# Altium schematic sheet Ram.SchDoc
size A3; Author: ALP Electronics; CompanyName: ALP Electronics; DrawnBy: Caner Alp; Engineer: Caner Alp; Organization: ALP Electronics; Address2: Västerås; Address4: Sweden; SheetNumber: 5; SheetTotal: 11
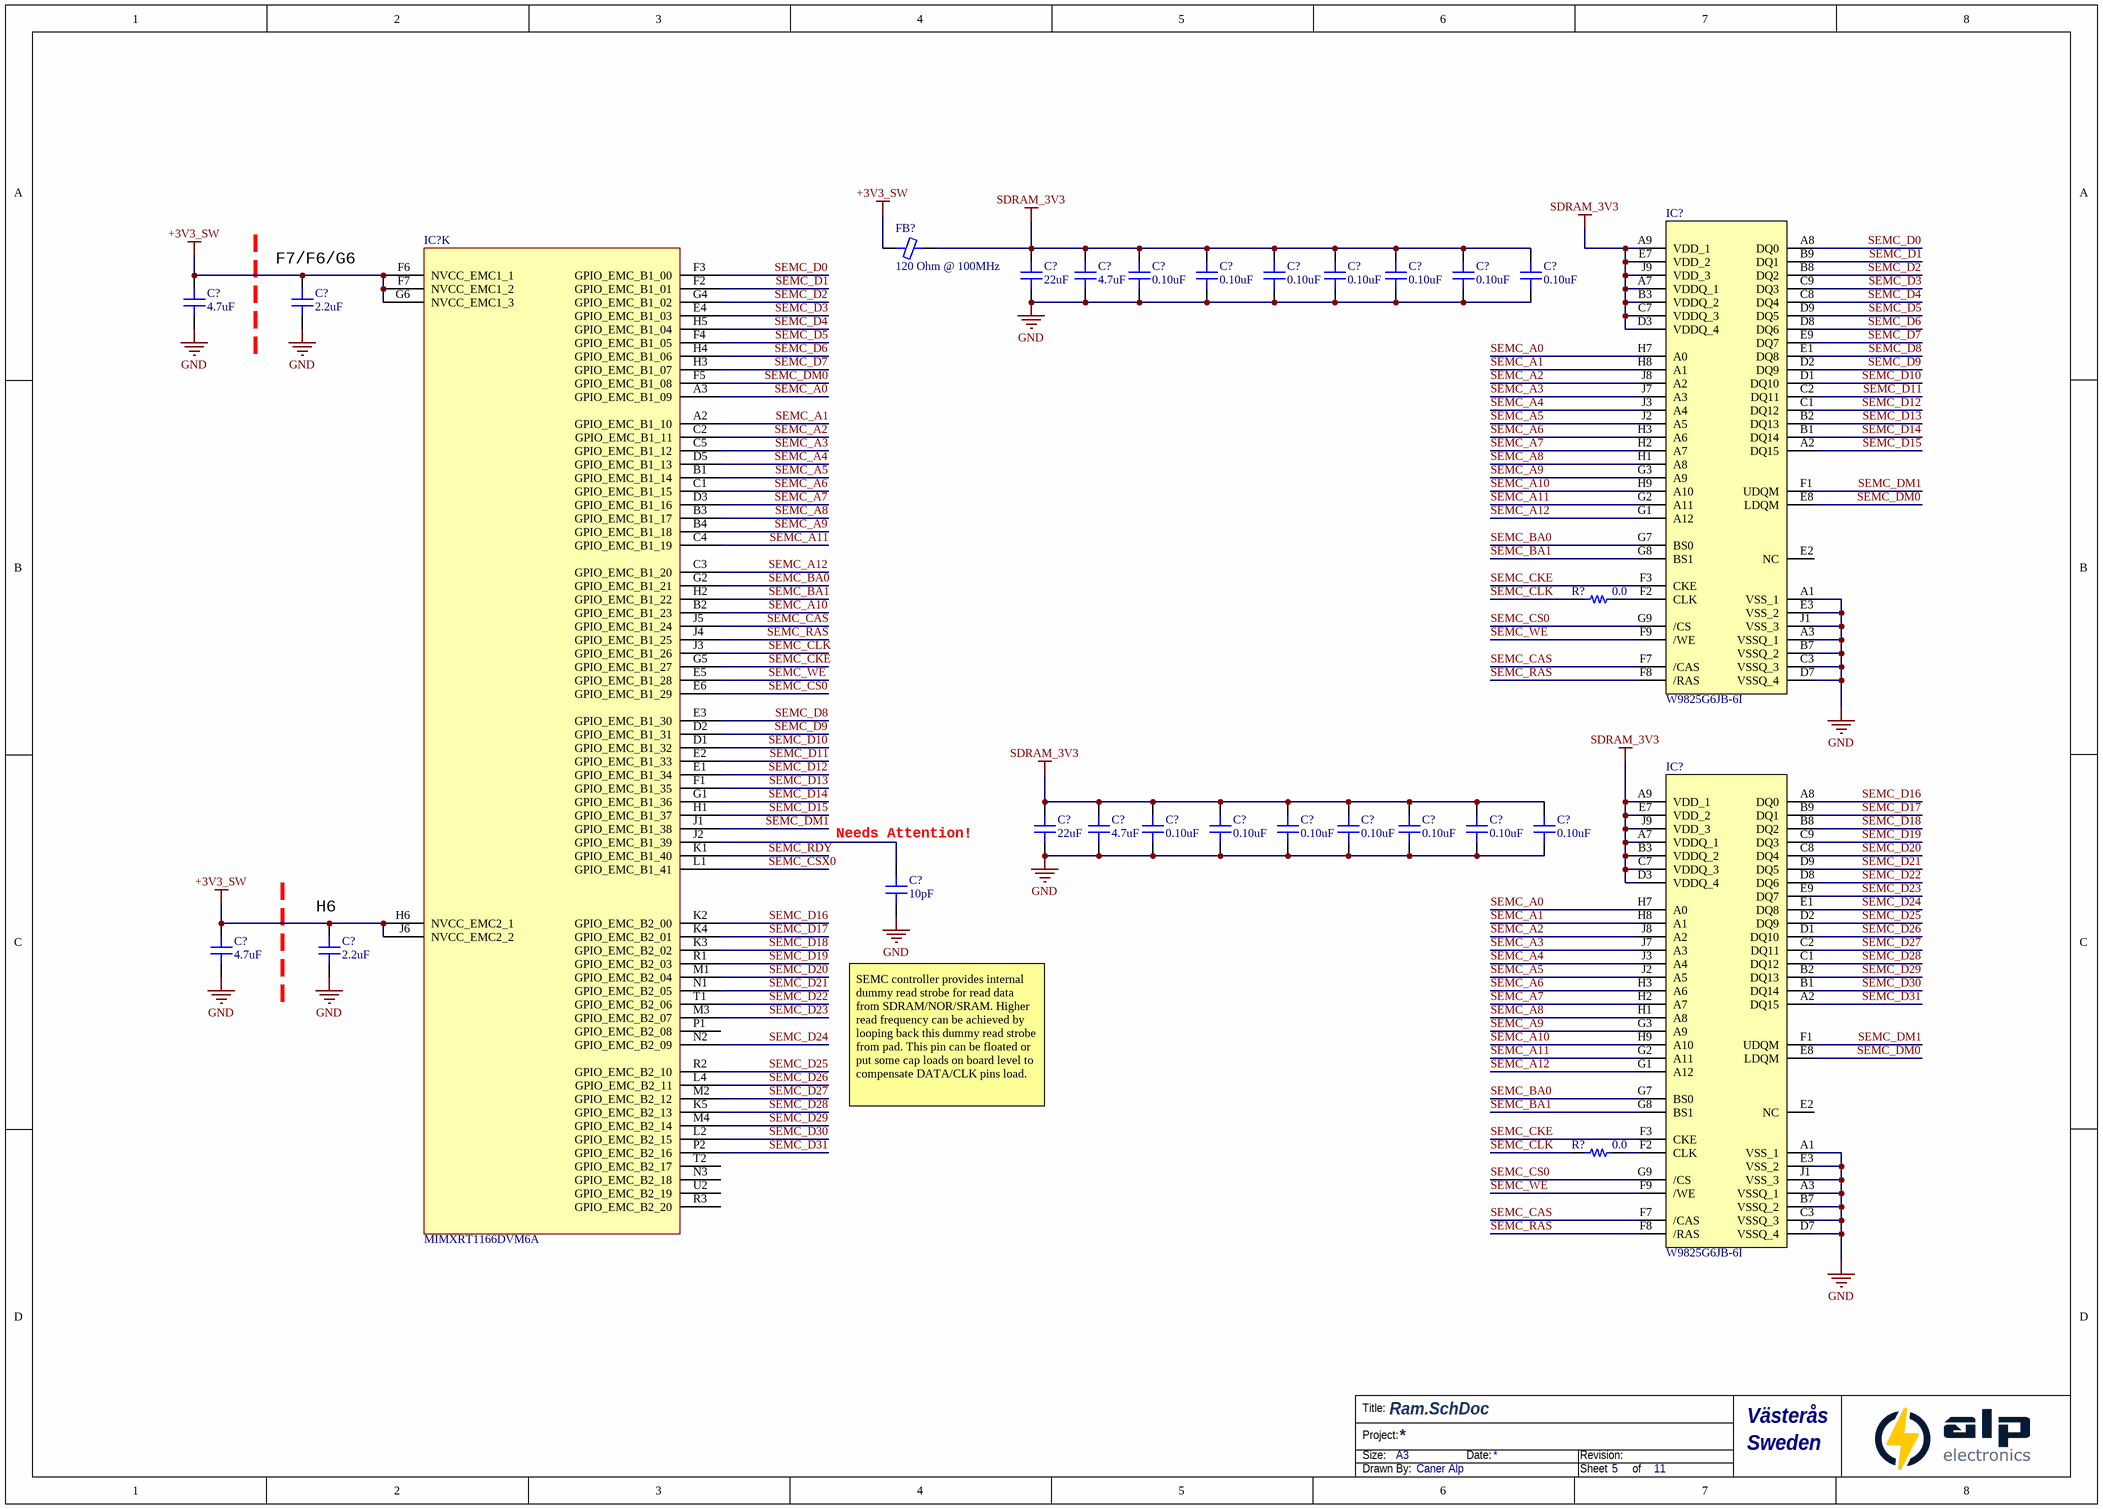
[diagram p0: Ram.SchDoc]

## Parts
(Parts that share a designator on the sheet are numbered #1, #2 ... from top to bottom, then left to right.)
C?#1  22uF  [CAP 0805/2012]
C?#2  4.7uF  [CAP 0402/1005]
C?#3  0.10uF  [CAP 0402/1005]
C?#4  0.10uF  [CAP 0402/1005]
C?#5  0.10uF  [CAP 0402/1005]
C?#6  0.10uF  [CAP 0402/1005]
C?#7  0.10uF  [CAP 0402/1005]
C?#8  0.10uF  [CAP 0402/1005]
C?#9  0.10uF  [CAP 0402/1005]
C?#10  4.7uF  [CAP 0402/1005]
C?#11  2.2uF  [CAP 0402/1005]
C?#12  22uF  [CAP 0805/2012]
C?#13  4.7uF  [CAP 0402/1005]
C?#14  0.10uF  [CAP 0402/1005]
C?#15  0.10uF  [CAP 0402/1005]
C?#16  0.10uF  [CAP 0402/1005]
C?#17  0.10uF  [CAP 0402/1005]
C?#18  0.10uF  [CAP 0402/1005]
C?#19  0.10uF  [CAP 0402/1005]
C?#20  0.10uF  [CAP 0402/1005]
C?#21  10pF  [CAP 0402/1005]
C?#22  4.7uF  [CAP 0402/1005]
C?#23  2.2uF  [CAP 0402/1005]
FB?  120 Ohm @ 100MHz  [FER 0402/1005]
IC?#1  MIMXRT1166DVM6A  [BGA289C80P17X17_1400X1400X152]  (part K of 12)
IC?#2  W9825G6JB-6I  [BGA54C80P9X9_800X800X120]
IC?#3  W9825G6JB-6I  [BGA54C80P9X9_800X800X120]
R?#1  0.0  [RES 0402/1005]
R?#2  0.0  [RES 0402/1005]

## Nets
+3V3_SW: C?#10.2 C?#11.2 C?#22.2 C?#23.2 FB?.1 IC?#1.F6(NVCC_EMC1_1) IC?#1.F7(NVCC_EMC1_2) IC?#1.G6(NVCC_EMC1_3) IC?#1.H6(NVCC_EMC2_1) IC?#1.J6(NVCC_EMC2_2)
GND: C?#1.1 C?#2.1 C?#3.1 C?#4.1 C?#5.1 C?#6.1 C?#7.1 C?#8.1 C?#9.1 C?#10.1 C?#11.1 C?#12.1 C?#13.1 C?#14.1 C?#15.1 C?#16.1 C?#17.1 C?#18.1 C?#19.1 C?#20.1 C?#21.1 C?#22.1 C?#23.1 IC?#2.A1(VSS_1) IC?#2.A3(VSSQ_1) IC?#2.B7(VSSQ_2) IC?#2.C3(VSSQ_3) IC?#2.D7(VSSQ_4) IC?#2.E3(VSS_2) IC?#2.J1(VSS_3) IC?#3.A1(VSS_1) IC?#3.A3(VSSQ_1) IC?#3.B7(VSSQ_2) IC?#3.C3(VSSQ_3) IC?#3.D7(VSSQ_4) IC?#3.E3(VSS_2) IC?#3.J1(VSS_3)
SDRAM_3V3: C?#1.2 C?#2.2 C?#3.2 C?#4.2 C?#5.2 C?#6.2 C?#7.2 C?#8.2 C?#9.2 C?#12.2 C?#13.2 C?#14.2 C?#15.2 C?#16.2 C?#17.2 C?#18.2 C?#19.2 C?#20.2 FB?.2 IC?#2.A7(VDDQ_1) IC?#2.A9(VDD_1) IC?#2.B3(VDDQ_2) IC?#2.C7(VDDQ_3) IC?#2.D3(VDDQ_4) IC?#2.E7(VDD_2) IC?#2.J9(VDD_3) IC?#3.A7(VDDQ_1) IC?#3.A9(VDD_1) IC?#3.B3(VDDQ_2) IC?#3.C7(VDDQ_3) IC?#3.D3(VDDQ_4) IC?#3.E7(VDD_2) IC?#3.J9(VDD_3)
SEMC_A0: IC?#1.A3(GPIO_EMC_B1_09) IC?#2.H7(A0) IC?#3.H7(A0)
SEMC_A1: IC?#1.A2(GPIO_EMC_B1_10) IC?#2.H8(A1) IC?#3.H8(A1)
SEMC_A2: IC?#1.C2(GPIO_EMC_B1_11) IC?#2.J8(A2) IC?#3.J8(A2)
SEMC_A3: IC?#1.C5(GPIO_EMC_B1_12) IC?#2.J7(A3) IC?#3.J7(A3)
SEMC_A4: IC?#1.D5(GPIO_EMC_B1_13) IC?#2.J3(A4) IC?#3.J3(A4)
SEMC_A5: IC?#1.B1(GPIO_EMC_B1_14) IC?#2.J2(A5) IC?#3.J2(A5)
SEMC_A6: IC?#1.C1(GPIO_EMC_B1_15) IC?#2.H3(A6) IC?#3.H3(A6)
SEMC_A7: IC?#1.D3(GPIO_EMC_B1_16) IC?#2.H2(A7) IC?#3.H2(A7)
SEMC_A8: IC?#1.B3(GPIO_EMC_B1_17) IC?#2.H1(A8) IC?#3.H1(A8)
SEMC_A9: IC?#1.B4(GPIO_EMC_B1_18) IC?#2.G3(A9) IC?#3.G3(A9)
SEMC_A10: IC?#1.B2(GPIO_EMC_B1_23) IC?#2.H9(A10) IC?#3.H9(A10)
SEMC_A11: IC?#1.C4(GPIO_EMC_B1_19) IC?#2.G2(A11) IC?#3.G2(A11)
SEMC_A12: IC?#1.C3(GPIO_EMC_B1_20) IC?#2.G1(A12) IC?#3.G1(A12)
SEMC_BA0: IC?#1.G2(GPIO_EMC_B1_21) IC?#2.G7(BS0) IC?#3.G7(BS0)
SEMC_BA1: IC?#1.H2(GPIO_EMC_B1_22) IC?#2.G8(BS1) IC?#3.G8(BS1)
SEMC_CAS: IC?#1.J5(GPIO_EMC_B1_24) IC?#2.F7(/CAS) IC?#3.F7(/CAS)
SEMC_CKE: IC?#1.G5(GPIO_EMC_B1_27) IC?#2.F3(CKE) IC?#3.F3(CKE)
SEMC_CLK: IC?#1.J3(GPIO_EMC_B1_26) R?#1.1 R?#2.1
SEMC_CS0: IC?#1.E6(GPIO_EMC_B1_29) IC?#2.G9(/CS) IC?#3.G9(/CS)
SEMC_CSX0: IC?#1.L1(GPIO_EMC_B1_41)
SEMC_D0: IC?#1.F3(GPIO_EMC_B1_00) IC?#2.A8(DQ0)
SEMC_D1: IC?#1.F2(GPIO_EMC_B1_01) IC?#2.B9(DQ1)
SEMC_D2: IC?#1.G4(GPIO_EMC_B1_02) IC?#2.B8(DQ2)
SEMC_D3: IC?#1.E4(GPIO_EMC_B1_03) IC?#2.C9(DQ3)
SEMC_D4: IC?#1.H5(GPIO_EMC_B1_04) IC?#2.C8(DQ4)
SEMC_D5: IC?#1.F4(GPIO_EMC_B1_05) IC?#2.D9(DQ5)
SEMC_D6: IC?#1.H4(GPIO_EMC_B1_06) IC?#2.D8(DQ6)
SEMC_D7: IC?#1.H3(GPIO_EMC_B1_07) IC?#2.E9(DQ7)
SEMC_D8: IC?#1.E3(GPIO_EMC_B1_30) IC?#2.E1(DQ8)
SEMC_D9: IC?#1.D2(GPIO_EMC_B1_31) IC?#2.D2(DQ9)
SEMC_D10: IC?#1.D1(GPIO_EMC_B1_32) IC?#2.D1(DQ10)
SEMC_D11: IC?#1.E2(GPIO_EMC_B1_33) IC?#2.C2(DQ11)
SEMC_D12: IC?#1.E1(GPIO_EMC_B1_34) IC?#2.C1(DQ12)
SEMC_D13: IC?#1.F1(GPIO_EMC_B1_35) IC?#2.B2(DQ13)
SEMC_D14: IC?#1.G1(GPIO_EMC_B1_36) IC?#2.B1(DQ14)
SEMC_D15: IC?#1.H1(GPIO_EMC_B1_37) IC?#2.A2(DQ15)
SEMC_D16: IC?#1.K2(GPIO_EMC_B2_00) IC?#3.A8(DQ0)
SEMC_D17: IC?#1.K4(GPIO_EMC_B2_01) IC?#3.B9(DQ1)
SEMC_D18: IC?#1.K3(GPIO_EMC_B2_02) IC?#3.B8(DQ2)
SEMC_D19: IC?#1.R1(GPIO_EMC_B2_03) IC?#3.C9(DQ3)
SEMC_D20: IC?#1.M1(GPIO_EMC_B2_04) IC?#3.C8(DQ4)
SEMC_D21: IC?#1.N1(GPIO_EMC_B2_05) IC?#3.D9(DQ5)
SEMC_D22: IC?#1.T1(GPIO_EMC_B2_06) IC?#3.D8(DQ6)
SEMC_D23: IC?#1.M3(GPIO_EMC_B2_07) IC?#3.E9(DQ7)
SEMC_D24: IC?#1.N2(GPIO_EMC_B2_09) IC?#3.E1(DQ8)
SEMC_D25: IC?#1.R2(GPIO_EMC_B2_10) IC?#3.D2(DQ9)
SEMC_D26: IC?#1.L4(GPIO_EMC_B2_11) IC?#3.D1(DQ10)
SEMC_D27: IC?#1.M2(GPIO_EMC_B2_12) IC?#3.C2(DQ11)
SEMC_D28: IC?#1.K5(GPIO_EMC_B2_13) IC?#3.C1(DQ12)
SEMC_D29: IC?#1.M4(GPIO_EMC_B2_14) IC?#3.B2(DQ13)
SEMC_D30: IC?#1.L2(GPIO_EMC_B2_15) IC?#3.B1(DQ14)
SEMC_D31: IC?#1.P2(GPIO_EMC_B2_16) IC?#3.A2(DQ15)
SEMC_DM0: IC?#1.F5(GPIO_EMC_B1_08) IC?#2.E8(LDQM) IC?#3.E8(LDQM)
SEMC_DM1: IC?#1.J1(GPIO_EMC_B1_38) IC?#2.F1(UDQM) IC?#3.F1(UDQM)
SEMC_RAS: IC?#1.J4(GPIO_EMC_B1_25) IC?#2.F8(/RAS) IC?#3.F8(/RAS)
SEMC_RDY: IC?#1.K1(GPIO_EMC_B1_40)
SEMC_WE: IC?#1.E5(GPIO_EMC_B1_28) IC?#2.F9(/WE) IC?#3.F9(/WE)
NetC?#21_2: C?#21.2 IC?#1.J2(GPIO_EMC_B1_39)
NetIC?#2_F2: IC?#2.F2(CLK) R?#1.2
NetIC?#3_F2: IC?#3.F2(CLK) R?#2.2

Not connected (* = marked no-connect by the designer): IC?#1 N3(GPIO_EMC_B2_18) P1(GPIO_EMC_B2_08) R3(GPIO_EMC_B2_20) T2(GPIO_EMC_B2_17) U2(GPIO_EMC_B2_19); IC?#2 E2(NC); IC?#3 E2(NC)

## Notes on the sheet
- (near C?#11) F7/F6/G6
- (near C?#21) Needs Attention!
- (near C?#23) H6
- SEMC controller provides internal dummy read strobe for read data from SDRAM/NOR/SRAM. Higher read frequency can be achieved by looping back this dummy read strobe from pad. This pin can be floated or put some cap loads on board level to compensate DATA/CLK pins load.
- Title:
- Size:
- Project:
- A3
- Date:
- Revision:
- Drawn By:
- Sheet
- of

## Library data of the parts
C?#1 C?#12 = C2012X5R0J226M125AC: CAP CER 22UF 6.3V X5R 0805; Manufacturer: TDK Corporation; TemperatureRange: -55C ~ 85C; Tolerance: 20%; Value: 22uF; Part Number: C2012X5R0J226M125AC; PartId: 4616; Supplier 1: Digi-Key; Supplier Part Number 1: 445-1422-2-ND; ComponentLink1Description: Datasheet; ComponentLink1URL: https://product.tdk.com/info/en/catalog/datasheets/mlcc_commercial_general_en.pdf; ComponentLink2Description: Digi-Key listing; ComponentLink2URL: http://digikey.com/product-detail/en/C2012X5R0J226M125AC/445-1422-2-ND/569048; TemperatureCoefficient: X5R; Voltage: 6.3V; Price: 0,0861; Type: -; Device Package: 0805 (2012 Metric)
C?#2 C?#10 C?#13 C?#22 = C0402C475M9PAC7867: CAP CER 4.7UF 6.3V X5R 0402; Manufacturer: Kemet; TemperatureRange: -55C ~ 85C; Tolerance: 20%; Value: 4.7uF; Part Number: C0402C475M9PAC7867; PartId: 12865; Supplier 1: Digi-Key; Supplier Part Number 1: 399-13068-2-ND; ComponentLink1Description: Datasheet; ComponentLink1URL: http://www.kemet.com/docfinder?Partnumber=C0402C475M9PAC7867; ComponentLink2Description: Digi-Key Listing; ComponentLink2URL: https://www.digikey.com/product-detail/en/kemet/C0402C475M9PAC7867/399-13068-2-ND/5767551; TemperatureCoefficient: X5R; Voltage: 6.3V; Price: 0,063; Device Package: 0402 (1005 Metric)
C?#3-C?#9 C?#14-C?#20 = LMK105BJ104KV-F: CAP CER 0.1UF 10V X5R 0402; Manufacturer: Taiyo Yuden; TemperatureRange: -55C ~ 85C; Tolerance: 10%; Value: 0.10uF; Part Number: LMK105BJ104KV-F; PartId: 12322; Supplier 1: Digi-Key; Supplier Part Number 1: 587-1227-2-ND; ComponentLink1Description: Datasheet; ComponentLink1URL: http://ds.yuden.co.jp/TYCOMPAS/ut/detail.do?productNo=LMK105BJ104KV-F&fileName=LMK105BJ104KV-F_SS&mode=specSheetDownload; ComponentLink2Description: Digi-Key Listing; ComponentLink2URL: https://www.digikey.com/product-detail/en/taiyo-yuden/LMK105BJ104KV-F/587-1227-2-ND/930579; TemperatureCoefficient: X5R; Voltage: 10V; Price: 0,0021; Device Package: 0402 (1005 Metric)
C?#11 C?#23 = JMK105BJ225MV-F: CAP CER 2.2UF 6.3V X5R 0402; Manufacturer: Taiyo Yuden; TemperatureRange: -55C ~ 85C; Tolerance: 20%; Value: 2.2uF; Part Number: JMK105BJ225MV-F; PartId: 12339; Supplier 1: Digi-Key; Supplier Part Number 1: 587-1453-2-ND; ComponentLink1Description: Datasheet; ComponentLink1URL: http://ds.yuden.co.jp/TYCOMPAS/ut/detail.do?productNo=JMK105BJ225MV-F&fileName=JMK105BJ225MV-F_SS&mode=specSheetDownload; ComponentLink2Description: Digi-Key Listing; ComponentLink2URL: https://www.digikey.com/product-detail/en/taiyo-yuden/JMK105BJ225MV-F/587-1453-2-ND/1004041; TemperatureCoefficient: X5R; Voltage: 6.3V; Price: 0,028; Device Package: 0402 (1005 Metric)
C?#21 = C1005C0G1H100D050BA: CAP CER 10PF 50V C0G 0402; Manufacturer: TDK Corporation; TemperatureRange: -55C ~ 125C; TemperatureCoefficient: C0G, NP0; Tolerance: 0.5pF; Value: 10pF; Part Number: C1005C0G1H100D050BA; PartId: 3878; Supplier 1: Digi-Key; Supplier Part Number 1: 445-1235-2-ND; ComponentLink1Description: Datasheet; ComponentLink1URL: https://product.tdk.com/info/en/catalog/datasheets/mlcc_commercial_general_en.pdf; ComponentLink2Description: Digi-Key listing; ComponentLink2URL: http://digikey.com/product-detail/en/C1005C0G1H100D050BA/445-1235-2-ND/513663; Voltage: 50V; Price: 0,006; Type: -; Device Package: 0402 (1005 Metric)
FB? = CIM05U121NC: FERRITE CHIP 120 OHM 600MA 0402; Manufacturer: Samsung Electro-Mechanics America, Inc.; Type: Differential Mode - Single; DC Resistance: 250 mOhm Max; Part Number: CIM05U121NC; PartId: 6447; Value: 120 Ohm @ 100MHz; Supplier 1: Digi-Key; Supplier Part Number 1: 1276-6345-2-ND; ComponentLink1Description: Datasheet; ComponentLink1URL: http://www.samsungsem.com/kr/front/downloadcms.do?path=/kr/support/product-search/bead/__icsFiles/afieldfile/2014/11/13&fileName=S_CIM05J102NC.pdf; ComponentLink2Description: Digi-Key listing; ComponentLink2URL: http://digikey.com/product-detail/en/CIM05U121NC/1276-6345-2-ND/3973775; Price: 0,0147; Device Package: 0402 (1005 Metric); Current Rating: 600mA
IC?#1 = MIMXRT1166DVM6A: Integrated Circuit; Manufacturer_Name: NXP; Datasheet Link: https://www.mouser.in/datasheet/2/302/IMXRT1160CEC-2335852.pdf; Height: 1.52mm; Manufacturer_Part_Number: MIMXRT1166DVM6A; Mouser Part Number: 771-MIMXRT1166DVM6A; Mouser Price/Stock: https://www.mouser.co.uk/ProductDetail/NXP-Semiconductors/MIMXRT1166DVM6A?qs=DRkmTr78QARbPfoaiaD1vg%3D%3D
IC?#2 IC?#3 = W9825G6JB-6I: Integrated Circuit; Manufacturer_Name: Winbond; Datasheet Link: https://www.arrow.com/en/products/w9825g6jb-6i/winbond-electronics; Height: 1.2mm; Manufacturer_Part_Number: W9825G6JB-6I; Mouser Part Number: 454-W9825G6JB-6I; Mouser Price/Stock: https://www.mouser.co.uk/ProductDetail/Winbond/W9825G6JB-6I?qs=qSfuJ%252Bfl%2Fd53SFnMseOCWQ%3D%3D; Arrow Part Number: W9825G6JB-6I; Arrow Price/Stock: https://www.arrow.com/en/products/w9825g6jb-6i/winbond-electronics
R?#1 R?#2 = RC0402JR-070RL: RES SMD 0.0OHM JUMPER 1/16W 0402; Manufacturer: Yageo; TemperatureRange: -55C ~ 155C; PowerRating: 0.063W, 1/16W; Value: 0.0; Part Number: RC0402JR-070RL; PartId: 16128; Supplier 1: Digi-Key; Supplier Part Number 1: 311-0.0JRTR-ND; ComponentLink1Description: Datasheet; ComponentLink1URL: http://www.yageo.com/documents/recent/PYu-RC_Group_51_RoHS_L_04.pdf; ComponentLink2Description: Digi-Key Listing; ComponentLink2URL: https://www.digikey.com/product-detail/en/yageo/RC0402JR-070RL/311-0.0JRTR-ND/726406; Tolerance: Jumper; Price: 0,0019; Device Package: 0402 (1005 Metric)